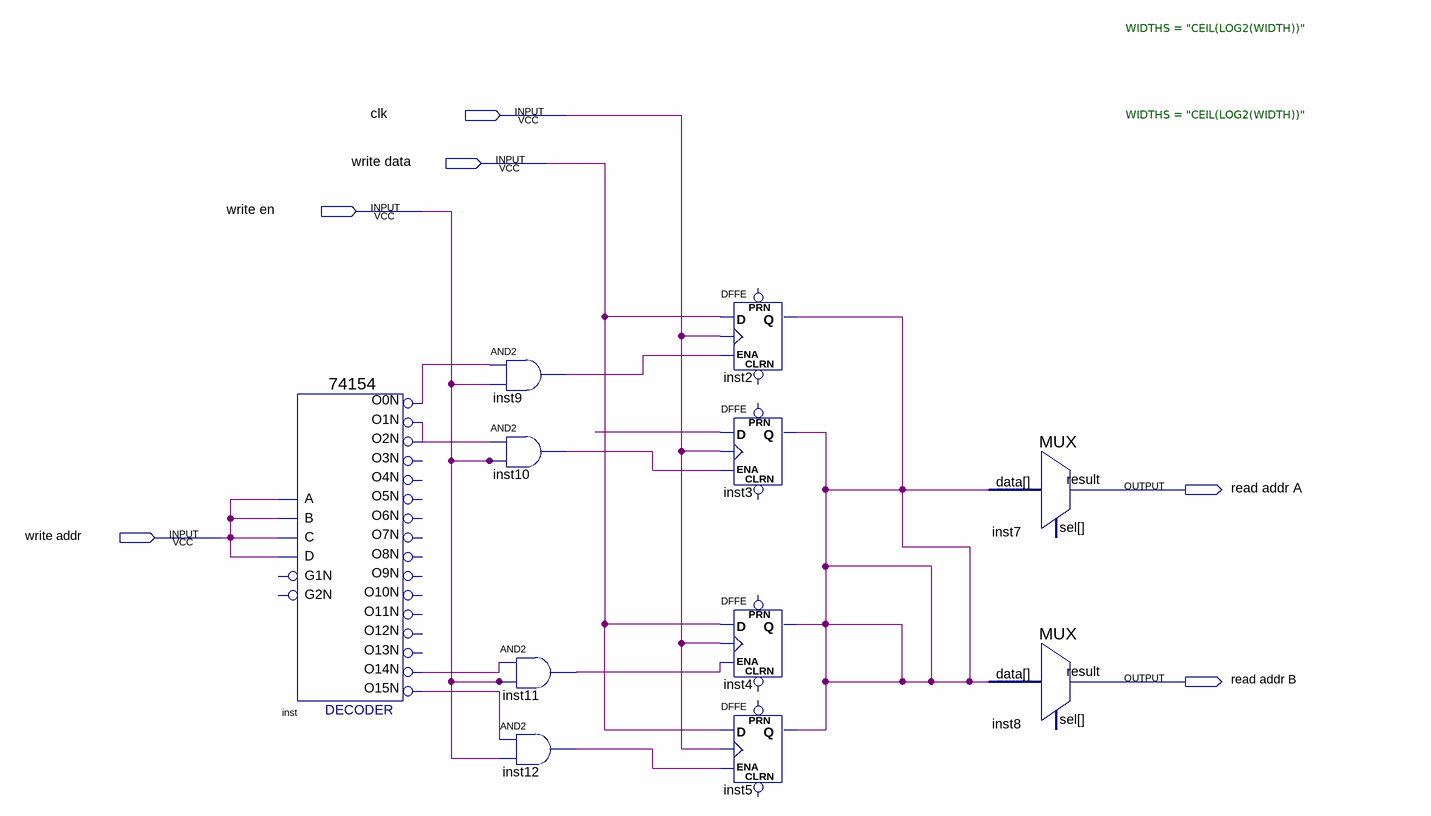
[diagram p0: schematic sheet]
// Quartus schematic Block1.bdf as structural Verilog: 11 symbols, 6 pins
module Block1 (
  input  clk,
  input  \write_data ,
  input  \write_en ,
  input  \write_addr ,
  output \read_addr_A ,
  output \read_addr_B 
);

  wire inst2_q, inst9_out, inst10_out, inst11_out, inst12_out, inst_o0n, inst_o1n, inst_o14n, inst_o15n,
       undriven;

  \74154  inst (
    .C(\write_addr ), .D(\write_addr ), .B(\write_addr ), .A(\write_addr ), .O0N(inst_o0n), .O15N(inst_o15n),
    .O1N(inst_o1n), .O14N(inst_o14n), .O2N(inst_o1n));  // open: G1N, G2N, O12N, O10N, O11N, O13N, O4N, O3N, O7N, O6N, O5N, O9N, O8N
  and inst9 (inst9_out, inst_o0n, \write_en );
  and inst10 (inst10_out, inst_o1n, \write_en );
  and inst11 (inst11_out, inst_o14n, \write_en );
  and inst12 (inst12_out, inst_o15n, \write_en );
  DFFE inst2 (.D(\write_data ), .CLK(clk), .ENA(inst9_out), .Q(inst2_q));  // open: PRN, CLRN
  DFFE inst3 (.D(undriven), .CLK(clk), .ENA(inst10_out), .Q(inst2_q));  // open: PRN, CLRN
  DFFE inst4 (.D(\write_data ), .CLK(clk), .ENA(inst11_out), .Q(inst2_q));  // open: PRN, CLRN
  DFFE inst5 (.D(\write_data ), .CLK(clk), .ENA(inst12_out), .Q(inst2_q));  // open: PRN, CLRN
  MUX #(.WIDTHS("CEIL(LOG2(WIDTH))")) inst7 (.data(inst2_q), .result(\read_addr_A ));  // open: sel
  MUX #(.WIDTHS("CEIL(LOG2(WIDTH))")) inst8 (.data(inst2_q), .result(\read_addr_B ));  // open: sel
endmodule
